# Altium schematic sheet PHY6222_32(0.4)_V1.7.SCHDOC
size A3
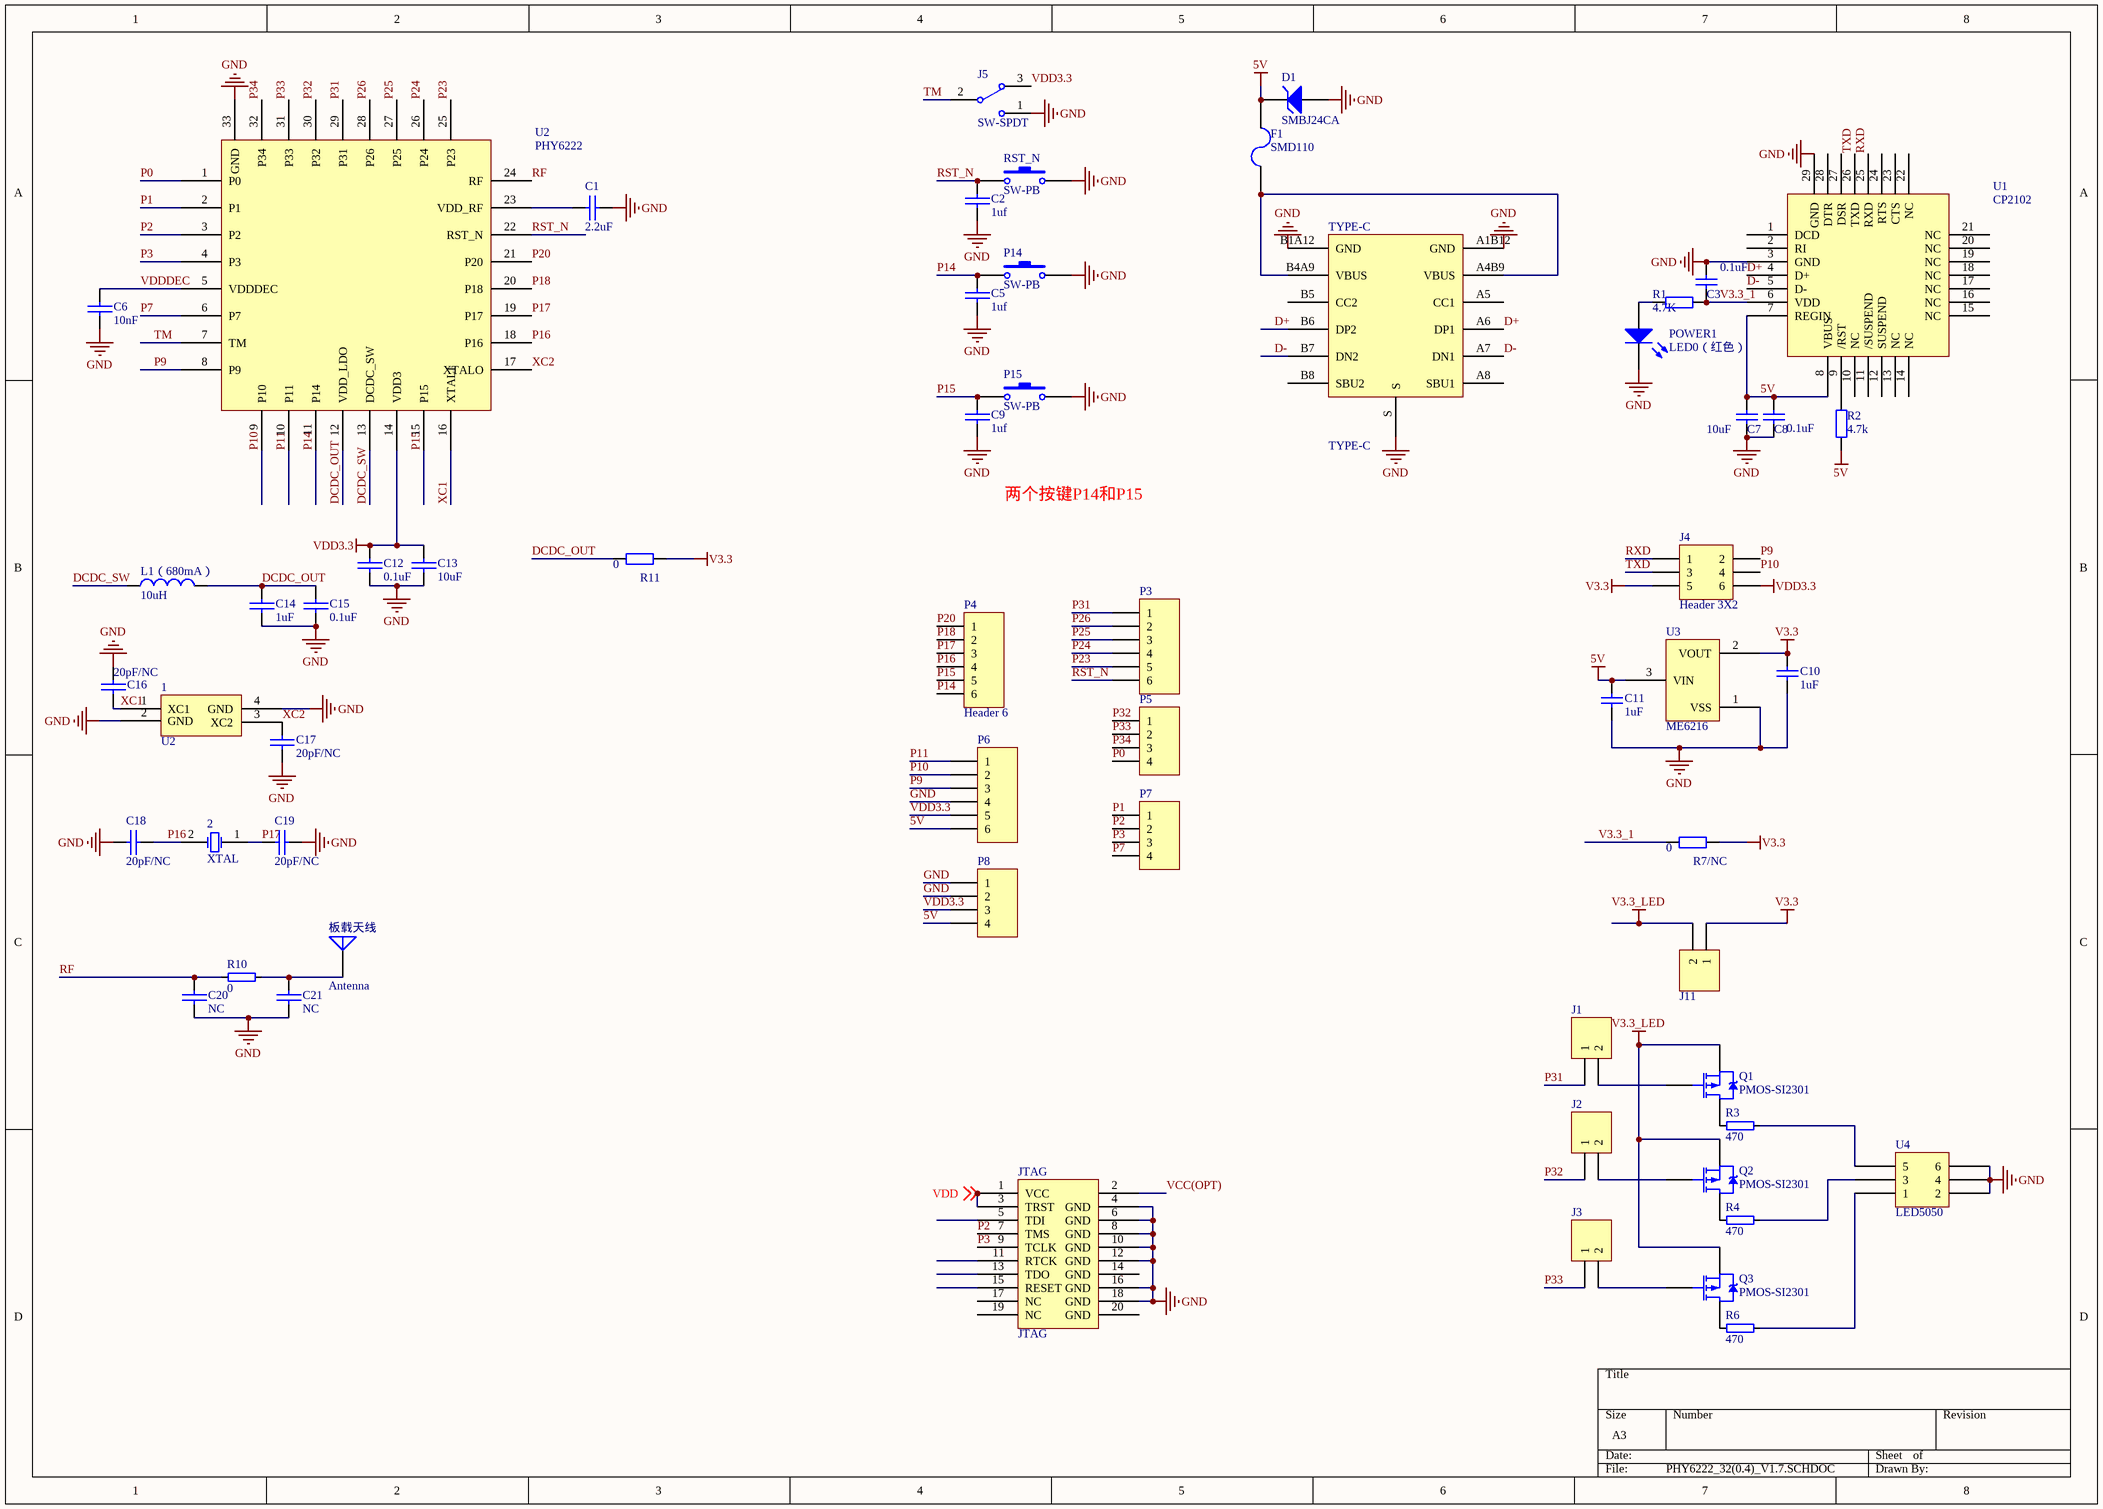
[diagram p0: PHY6222_32(0.4)_V1.7.SCHDOC]

## Parts
1  U2  [3225]
2  XTAL  [3215   32.768k]
C1  2.2uF  [C0402]
C2  1uf  [C0402]
C3  0.1uF  [C0402]
C5  1uf  [C0402]
C6  10nF  [C0402]
C7  10uF  [0603R]
C8  0.1uF  [C0402]
C9  1uf  [C0402]
C10  1uF  [C0402]
C11  1uF  [C0402]
C12  0.1uF  [C0402]
C13  10uF  [C0603]
C14  1uF  [C0402]
C15  0.1uF  [C0402]
C16  20pF/NC  [C0402]
C17  20pF/NC  [C0402]
C18  20pF/NC  [C0402]
C19  20pF/NC  [C0402]
C20  NC  [C0402]
C21  NC  [C0402]
D1  SMBJ24CA  [1N5819S]
F1  SMD110  [1812]
J1  Header 2  [HDR1X2]  (value not drawn)
J2  Header 2  [HDR1X2]  (value not drawn)
J3  Header 2  [HDR1X2]  (value not drawn)
J4  Header 3X2  [HDR2X3]
J5  SW-SPDT  [HDR1X3]
J11  Header 2  [HDR1X2]  (value not drawn)
JTAG  JTAG  [JTAG1]
L1（680mA）  10uH  [SMD2520]
P3  MHDR1X6  [HDR1X6]  (value not drawn)
P4  Header 6  [HDR1X6]
P5  MHDR1X4  [HDR1X4]  (value not drawn)
P6  MHDR1X6  [HDR1X6]  (value not drawn)
P7  MHDR1X4  [HDR1X4]  (value not drawn)
P8  MHDR1X4  [HDR1X4]  (value not drawn)
P14  SW-PB  [SW  3*4*2]
P15  SW-PB  [SW  3*4*2]
POWER1  LED0（红色）  [LED0603]
Q1  PMOS-SI2301  [SOT-23]
Q2  PMOS-SI2301  [SOT-23]
Q3  PMOS-SI2301  [SOT-23]
R1  4.7K  [R0402]
R2  4.7k  [R0402]
R3  470  [R0402]
R4  470  [R0402]
R6  470  [R0402]
R7/NC  value 0  [R0603]  (hidden comment: 4.7K)
R10  0  [R0402]
R11  value 0  [R0603]  (hidden comment: 4.7K)
RST_N  SW-PB  [SW  3*4*2]
TYPE-C  TYPE-C  [TYPE-C]
U1  CP2102  [CP2102]
U2  PHY6222  [QFN32_0.4]
U3  ME6216  [SOT-23]
U4  LED5050  [LED5050]
板载天线  Antenna  [PIN1]

## Nets
5V: C7.2 C8.2 C11.1 D1.2(K) F1.2 P6.6 P8.4 R2.1 U1.7(REGIN) U1.8(VBUS) U3.3(VIN)
GND: 1.2(GND) 1.4(GND) C1.2 C2.2 C3.2 C5.2 C6.2 C7.1 C8.1 C9.2 C10.2 C11.2 C12.2 C13.2 C14.2 C15.2 C16.1 C17.1 C18.1 C19.1 C20.2 C21.2 D1.1(A) J5.1 JTAG.4(GND) JTAG.6(GND) JTAG.8(GND) JTAG.10(GND) JTAG.12(GND) JTAG.16(GND) JTAG.18(GND) P6.4 P8.1 P8.2 P14.2 P15.2 POWER1.2(K) RST_N.2 TYPE-C.A1B12(GND) TYPE-C.B1A12(GND) TYPE-C.S U1.3(GND) U1.29(GND) U2.33(GND) U3.1(VSS) U4.2 U4.4 U4.6
V3.3: C10.1 J4.5 J11.1 R7/NC.2 R11.2 U3.2(VOUT)
V3.3_LED: J11.2 Q1.3(S) Q2.3(S) Q3.3(S)
VDD3.3: C12.1 C13.1 J4.6 J5.3 P6.5 P8.3 U2.14(VDD3)
D+: TYPE-C.A6(DP1) TYPE-C.B6(DP2) U1.4(D+)
D-: TYPE-C.A7(DN1) TYPE-C.B7(DN2) U1.5(D-)
DCDC_OUT: C14.1 C15.1 L1（680mA）.2 R11.1 U2.12(VDD_LDO)
DCDC_SW: L1（680mA）.1 U2.13(DCDC_SW)
P0: P5.4 U2.1(P0)
P1: P7.1 U2.2(P1)
P2: JTAG.7(TMS) P7.2 U2.3(P2)
P3: JTAG.9(TCLK) P7.3 U2.4(P3)
P7: P7.4 U2.6(P7)
P9: J4.2 P6.3 U2.8(P9)
P10: J4.4 P6.2 U2.9(P10)
P11: P6.1 U2.10(P11)
P14: C5.1 P4.6 P14.1 U2.11(P14)
P15: C9.1 P4.5 P15.1 U2.15(P15)
P16: 2.2(OSC2) C18.2 P4.4 U2.18(P16)
P17: 2.1(OSC1) C19.2 P4.3 U2.19(P17)
P18: P4.2 U2.20(P18)
P20: P4.1 U2.21(P20)
P23: P3.5 U2.25(P23)
P24: P3.4 U2.26(P24)
P25: P3.3 U2.27(P25)
P26: P3.2 U2.28(P26)
P31: J1.1 P3.1 U2.29(P31)
P32: J2.1 P5.1 U2.30(P32)
P33: J3.1 P5.2 U2.31(P33)
P34: P5.3 U2.32(P34)
RF: C20.1 R10.1 U2.24(RF)
RST_N: C2.1 P3.6 RST_N.1 U2.22(RST_N)
RXD: J4.1 U1.25(RXD)
TM: J5.2 U2.7(TM)
TXD: J4.3 U1.26(TXD)
V3.3_1: C3.1 R1.2 R7/NC.1 U1.6(VDD)
VCC(OPT): JTAG.2
VDD: JTAG.1(VCC) JTAG.3(TRST) ; off-sheet VDD
VDDDEC: C6.1 U2.5(VDDDEC)
XC1: 1.1(XC1) C16.2 U2.16(XTALI)
XC2: 1.3(XC2) C17.2 U2.17(XTALO)
NetC1_1: C1.1 U2.23(VDD_RF)
NetC21_1: C21.1 R10.2 板载天线.1(A)
NetF1_1: F1.1 TYPE-C.A4B9(VBUS) TYPE-C.B4A9(VBUS)
NetJ1_2: J1.2 Q1.1(G)
NetJ2_2: J2.2 Q2.1(G)
NetJ3_2: J3.2 Q3.1(G)
NetPOWER1_1: POWER1.1(A) R1.1
NetQ1_2: Q1.2(D) R3.1
NetQ2_2: Q2.2(D) R4.1
NetQ3_2: Q3.2(D) R6.1
NetR2_2: R2.2 U1.9(/RST)
NetR3_2: R3.2 U4.5
NetR4_2: R4.2 U4.3
NetR6_2: R6.2 U4.1

Not connected (* = marked no-connect by the designer): JTAG 5(TDI) 11(RTCK) 13(TDO) 14(GND) 15(RESET) 17(NC) 19(NC) 20(GND); TYPE-C A5(CC1) A8(SBU1) B5(CC2) B8(SBU2); U1 1(DCD) 2(RI) 10(NC) 11(/SUSPEND) 12(SUSPEND) 13(NC) 14(NC) 15(NC) 16(NC) 17(NC) 18(NC) 19(NC) 20(NC) 21(NC) 22(NC) 23(CTS) 24(RTS) 27(DSR) 28(DTR)

## Notes on the sheet
- 两个按键P14和P15

## Library data of the parts
1 = 3225
2 = XTAL: Crystal Oscillator; Published: 8-Jun-2000; LatestRevisionDate: 17-Jul-2002; LatestRevisionNote: Re-released for DXP Platform.; PackageReference: R38; Publisher: Altium Limited; PackageDescription: Crystal, Thru-Hole; 2 Leads; Body 3.1 x 8.2 mm (Dia.xH)
C1 C2 C5 C6 C9 C12-C21 = 电容瓷片
C3 C7 C8 C10 C11 = Cap: Capacitor; Value: 100pF; Published: 8-Jun-2000; LatestRevisionDate: 17-Jul-2002; LatestRevisionNote: Re-released for DXP Platform.; PackageReference: RAD-0.3; Publisher: Altium Limited; PackageDescription: Radial Cap, Thru-Hole; 2 Leads; 0.3 in Pin Spacing
D1 = D Zener: Zener Diode; Published: *; Publisher: *; Manufacturer: *; Class: *; SubClass: *
F1 = FUSE2: Fuse
J1-J3 J11 = Header 2: Header, 2-Pin; LatestRevisionDate: 17-Jul-2002; LatestRevisionNote: Re-released for DXP Platform.; Publisher: Altium Limited
J4 = Header 3X2: Header, 3-Pin, Dual row; LatestRevisionDate: 17-Jul-2002; LatestRevisionNote: Re-released for DXP Platform.; Publisher: Altium Limited
J5 = SW-SPDT: SPDT Subminiature Toggle Switch, Right Angle Mounting, Vertical Actuation; Published: 24-Mar-1999; LatestRevisionDate: 17-Dec-2003; LatestRevisionNote: Schematic revised, PCB Footprint replaced.; DatasheetVersion: 05-Dec-2000; PackageReference: TL36WW15050; Publisher: Altium Limited; PackageDescription: Switch; 4 Leads; ComponentLink1Description: Manufacturer Link; ComponentLink1URL: http://www.apem.com
L1（680mA） = 电感: Code_IEC: 1005; Value: 2.2uH; Published: 8-Jun-2000; LatestRevisionDate: 17-Jul-2002; LatestRevisionNote: Re-released for DXP Platform.; PackageReference: 0402-A; Publisher: Altium Limited; Code_JEITA: 0402
P3 P6 = MHDR1X6: Header, 6-Pin; LatestRevisionDate: 17-Jul-2002; LatestRevisionNote: Re-released for DXP Platform.; Publisher: Altium Limited
P4 = Header 6: Header, 6-Pin; LatestRevisionDate: 17-Jul-2002; LatestRevisionNote: Re-released for DXP Platform.; Publisher: Altium Limited
P5 P7 P8 = MHDR1X4: Header, 4-Pin; LatestRevisionDate: 17-Jul-2002; LatestRevisionNote: Re-released for DXP Platform.; Publisher: Altium Limited
P14 P15 RST_N = SW-PB: Switch; Published: 24-Mar-1999; LatestRevisionDate: 17-Jul-2002; LatestRevisionNote: Re-released for DXP Platform.; PackageReference: SPST-2; Publisher: Altium Limited; PackageDescription: Switch; 2 Leads
POWER1 = LED0: Typical INFRARED GaAs LED; Published: 8-Jun-2000; LatestRevisionDate: 08-Jul-2005; LatestRevisionNote: Mech Layer 1 removed.; PackageReference: LED-0; Publisher: Altium Limited; PackageDescription: LED; 2 Leads
Q1-Q3 = PMOS-2: P-Channel Power MOSFET; Note: Pin 4 not drawn and electrically connected to Pin 2.; Published: 8-Jun-2000; LatestRevisionDate: 17-Jul-2002; LatestRevisionNote: Re-released for DXP Platform.; DatasheetVersion: PD-9.390D; PackageVersion: Feb-1997; PackageReference: TO-220AB; Publisher: Altium Limited; PackageDescription: TO, Thru-Hole, Vertical, Heatsink Mounted; 3 In-Line Leads; Pitch 2.54 mm; ComponentLink1Description: Manufacturer Link; ComponentLink1URL: http://www.irf.com/
R1 R2 R7/NC R11 = Res2: Resistor; Published: 8-Jun-2000; LatestRevisionDate: 17-Jul-2002; LatestRevisionNote: Re-released for DXP Platform.; PackageReference: AXIAL-0.4; Publisher: Altium Limited; PackageDescription: Axial Device, Thru-Hole; 2 Leads; 0.4 in Pin Spacing
  R1: Value: 4.7K
  R2: Value: 4.7k
R3 R4 R6 R10 = 电阻贴片
U2 = QFN32-1202
板载天线 = Antenna: Generic Antenna; Published: 24-Mar-1999; LatestRevisionDate: 17-Jul-2002; LatestRevisionNote: Re-released for DXP Platform.; PackageReference: PIN1; Publisher: Altium Limited